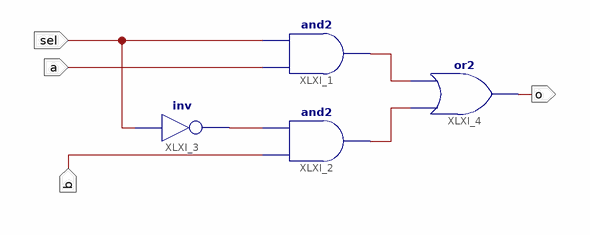
[diagram p0: schematic sheet 1]
// Xilinx ISE schematic mux2t1.sch (kintex7) as structural Verilog: 4 symbols, 4 ports
module mux2t1 (
  input  a,
  input  sel,
  input  b,
  output o
);

  wire XLXN_5, XLXN_7, XLXN_11;

  and XLXI_1 (XLXN_5, a, sel);
  and XLXI_2 (XLXN_7, b, XLXN_11);
  not XLXI_3 (XLXN_11, sel);
  or XLXI_4 (o, XLXN_7, XLXN_5);
endmodule
